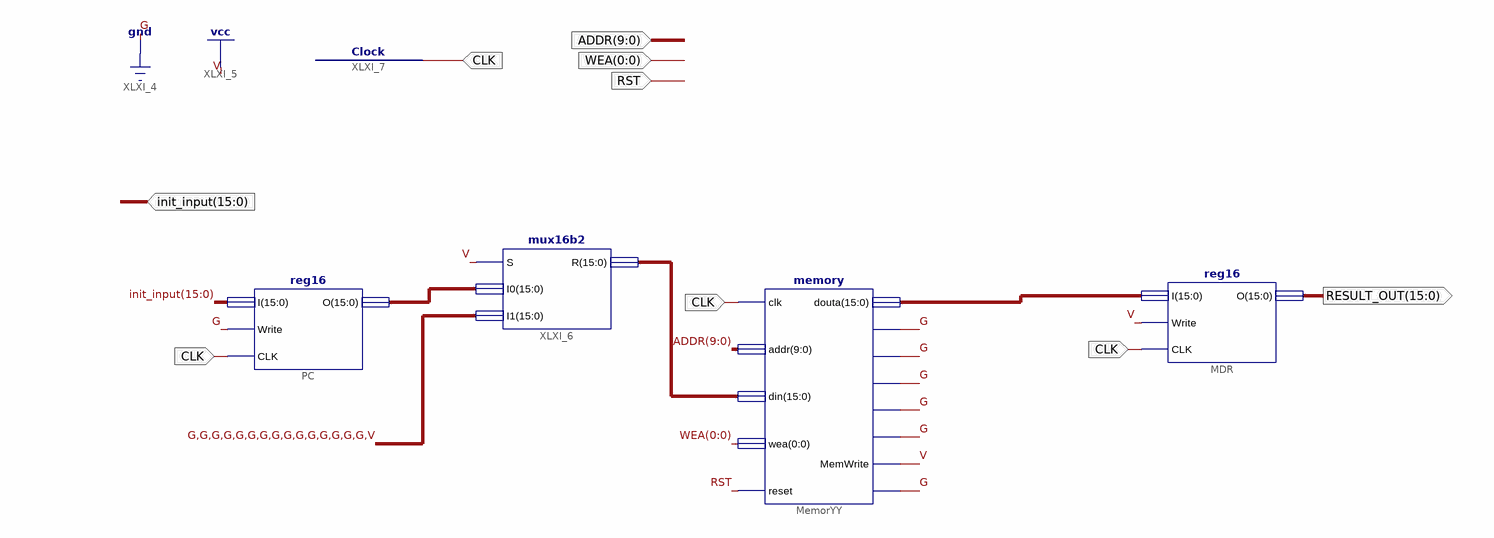
[diagram p0: schematic sheet 1]
// Xilinx ISE schematic Step1.sch (spartan3e) as structural Verilog: 5 symbols, 6 ports
module Step1 (
  input  CLK,
  input  [9:0] ADDR,
  input  [0:0] WEA,
  input  RST,
  input  [15:0] init_input,
  output [15:0] RESULT_OUT
);

  wire [15:0] XLXN_9, XLXN_11, XLXN_12;

  reg16 PC (.I(init_input), .Write(1'b0), .CLK(CLK), .O(XLXN_9));
  memory MemorYY (
    .clk(CLK), .addr(ADDR), .din(XLXN_12), .wea(WEA[0]), .reset(RST), .douta(XLXN_11), .ALUSrc(1'b0),
    .MemtoReg(1'b0), .RegDst(1'b0), .RegWrite(1'b0), .MemRead(1'b0), .MemWrite(1'b1), .Branch(1'b0));
  reg16 MDR (.I(XLXN_11), .Write(1'b1), .CLK(CLK), .O(RESULT_OUT));
  mux16b2 XLXI_6 (.S(1'b1), .I0(XLXN_9), .I1(16'b0000000000000001), .R(XLXN_12));
  Clock XLXI_7 ();
endmodule
